# Altium project tesovoe.PrjPcb
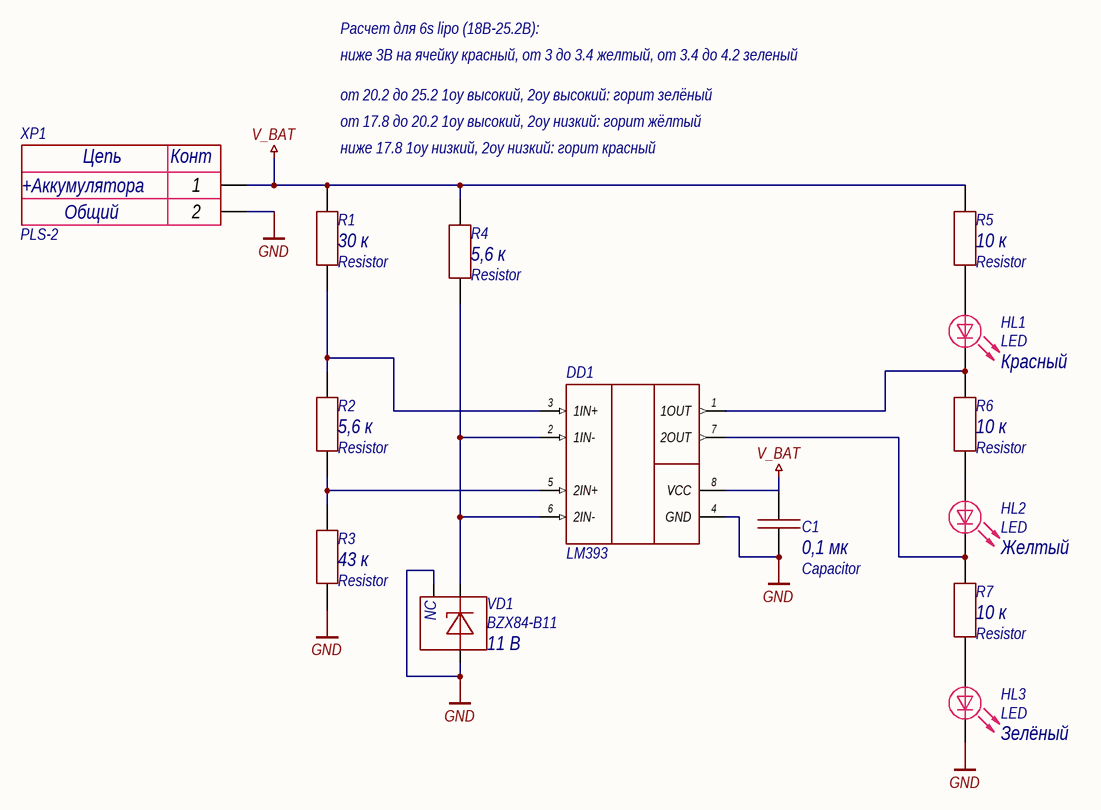
[diagram p0: Sheet1.SchDoc]
1 sheet, 14 parts. Net scope: global (net labels, ports and power ports of the same name join across sheets).
Board file: indikator.PcbDoc

## Sheet Sheet1.SchDoc
size A4; SheetNumber: 1; SheetTotal: 1

### Parts
C1  Capacitor  value 0,1 мк  [0603C]
DD1  LM393  [SOIC-8]
HL1  LED  Color: Красный  [0805D]
HL2  LED  Color: Желтый  [0805D]
HL3  LED  Color: Зелёный  [0805D]
R1  Resistor  value 30 к  [0603R]
R2  Resistor  value 5,6 к  [0603R]
R3  Resistor  value 43 к  [0603R]
R4  Resistor  value 5,6 к  [0603R]
R5  Resistor  value 10 к  [0603R]
R6  Resistor  value 10 к  [0603R]
R7  Resistor  value 10 к  [0603R]
VD1  BZX84-B11  value 11 В  [SOT23-3]
XP1  PLS-2  Value2: Общий  [PLS2]

### Nets
GND: C1.1 DD1.4(GND) HL3.2 R3.1 VD1.1 VD1.2 XP1.2
V_BAT: C1.2 DD1.8(VCC) R1.2 R4.2 R5.2 XP1.1
NetDD1_1: DD1.1(1OUT) HL1.2 R6.2
NetDD1_2: DD1.2(1IN-) DD1.6(2IN-) R4.1 VD1.3
NetDD1_3: DD1.3(1IN+) R1.1 R2.2
NetDD1_5: DD1.5(2IN+) R2.1 R3.2
NetDD1_7: DD1.7(2OUT) HL2.2 R7.2
NetHL1_1: HL1.1 R5.1
NetHL2_1: HL2.1 R6.1
NetHL3_1: HL3.1 R7.1

### Notes on the sheet
- Расчет для 6s lipo (18В-25.2В):
- ниже 3В на ячейку красный, от 3 до 3.4 желтый, от 3.4 до 4.2 зеленый
- от 20.2 до 25.2 1оу высокий, 2оу высокий: горит зелёный
- от 17.8 до 20.2 1оу высокий, 2оу низкий: горит жёлтый
- ниже 17.8 1оу низкий, 2оу низкий: горит красный
- (in symbol BZX84-B11) NC
- (in symbol PLS-2) Цепь; Конт

### Library data of the parts
C1 = Capacitor_0,1u_10_50V_X7R_0603C: Конденсатор; Tolerance: 0,1; Voltage (V): 50; Dielectric: X7R; Capacity (nF): 100; Part Number: Capacitor_0,1u_10_50V_X7R_0603C
DD1 = LM393: Двойной маломощный компаратор напряжения; MF: Texas Instruments; MP: LM393D; SnapEDA_Link: https://www.snapeda.com/parts/LM393D/Texas+Instruments/view-part/?ref=snap; Package: SOIC-8 Texas Instruments; Value: *; Check_prices: https://www.snapeda.com/parts/LM393D/Texas+Instruments/view-part/?ref=eda; Part Number: LM393
HL1-HL3 = LED: Светодиод; Part Number: LED
R1 = Resistor_30k_1_0603: Резистор номиналом 30 кОм и точностью 1%; Power: *; Part Number: Resistor_30k_1_0603; Tolerance: 1%
R2 R4 = Resistor_5.6k_1_0603: Резистор номиналом 5,6 кОм и точностью 1%; Power: *; Part Number: Resistor_5.6k_1_0603; Tolerance: 1%
R3 = Resistor_43k_1_0603: Резистор номиналом 43 кОм и точностью 1%; Power: *; Part Number: Resistor_43k_1_0603; Tolerance: 1%
R5-R7 = Resistor_10k_1_0603: Резистор номиналом 10 кОм и точностью 1%; Power: *; Part Number: Resistor_10k_1_0603; Tolerance: 1%
VD1 = BZX84-B11: Стабилитрон на 11 В, рассеиваемая мощность 0.25 Вт; Voltage nominal (V): 11; Current nominal (mA): 5; Power (W): 0.25; Accuracy: 0,02; Part Number: BZX84-B11
XP1 = PLS-2: +Аккумулятора; Value1: +Аккумулятора; Part Number: PLS-2